# Altium schematic sheet Connector-SDCard.SchDoc: =ProjectTitle
size 297 x 209 mm; Address1: Address1; Address2: Address2; Address3: Address3; Address4: Address4; SheetNumber: 15; SheetTotal: 16; Scale: 1:1; DocumentType: Схема электрическая принципиальная
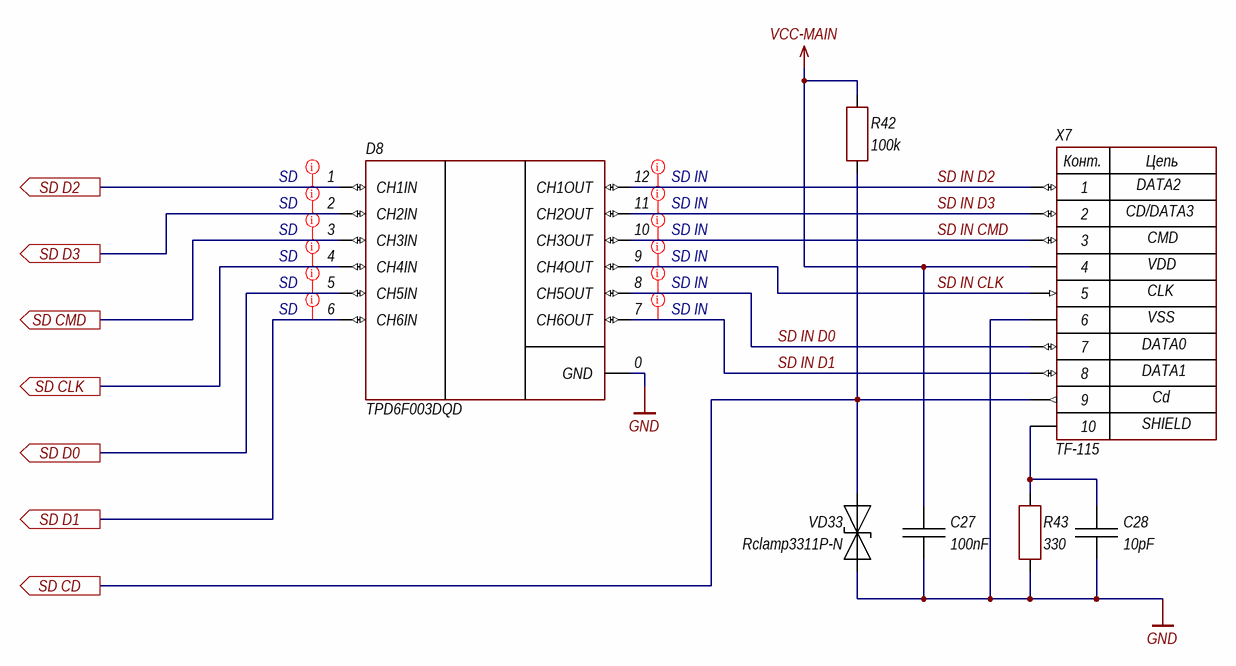
[diagram p0: Connector-SDCard.SchDoc]

## Parts
C27  100nF  [CH0402C]
C28  10pF  [CH0402C]
D8  TPD6F003DQD  [12-WSON (2.5x1.35 mm)]
R42  100k  [CH0402R]
R43  330  [CH0402R]
VD33  Rclamp3311P-N  [DFN1006-2]
X7  TF-115  [CON: MicroSD 14x15mm]

## Ports
SD CD (out), SD CLK (out), SD CMD (out), SD D0 (out), SD D1 (out), SD D2 (out), SD D3 (out)

## Nets
GND: C27.1 C28.1 D8.0(GND) R43.1 VD33.1(A) X7.6
VCC-MAIN: C27.2 R42.2 X7.4
SD CD: R42.1 VD33.2(C) X7.9 ; port SD CD
SD CLK: D8.4(CH4IN) ; port SD CLK
SD CMD: D8.3(CH3IN) ; port SD CMD
SD D0: D8.5(CH5IN) ; port SD D0
SD D1: D8.6(CH6IN) ; port SD D1
SD D2: D8.1(CH1IN) ; port SD D2
SD D3: D8.2(CH2IN) ; port SD D3
SD IN CLK: D8.9(CH4OUT) X7.5
SD IN CMD: D8.10(CH3OUT) X7.3
SD IN D0: D8.8(CH5OUT) X7.7
SD IN D1: D8.7(CH6OUT) X7.8
SD IN D2: D8.12(CH1OUT) X7.1
SD IN D3: D8.11(CH2OUT) X7.2
NetC28_2: C28.2 R43.2 X7.10

## Layout directives
net class SD IN; rule Matched Net Lengths [Tolerance = 2.54mm]: SD IN CLK, SD IN CMD, SD IN D0, SD IN D1, SD IN D2, SD IN D3
net class SD; rule Matched Net Lengths [Tolerance = 2.54mm]: SD CLK, SD CMD, SD D0, SD D1, SD D2, SD D3

## Notes on the sheet
- Изм.
- Лист
- № докум.
- Подп.
- Дата
- Копировал
- Формат А4
- (in symbol MicroSD) Конт.; Цепь; DATA2; CD/DATA3; CMD; VDD; CLK; VSS; DATA0; DATA1; Cd; SHIELD

## Library data of the parts
C27 C28 = Capacitor: Manufacturer: *; Model: *; HelpURL: *; ComponentKind: *
  C27: Value: 100nF
  C28: Value: 10pF
D8 = TPD6F003: 6-bit IO protection; Manufacturer: Texas Instruments; Model: TPD6F003DQD; ComponentKind: EMI Filter With Integrated ESD Protection; HelpURL: https://www.chipdip.ru/product0/8002872337
R42 R43 = Resistor: Manufacturer: *; Model: *; HelpURL: *; ComponentKind: *
  R42: Value: 100k
  R43: Value: 330
VD33 = TVS-diod: Manufacturer: BORN; ComponentKind: 3.3V, 8V. 10A; Model: Rclamp3311P-N; HelpURL: https://www.lcsc.com/product-detail/ESD-Protection-Devices_BORN-Rclamp3311P-N_C406234.html
X7 = MicroSD: µSD connector; Manufacturer: XUNPU; Model: TF-115; HelpURL: https://www.lcsc.com/product-detail/Card-Sockets-Connectors_XUNPU-TF-115_C266620.html; ComponentKind: µSD Connector